# EAGLE design controller_v4 (EAGLE 7.1.0)

## Sheet 1 of 4
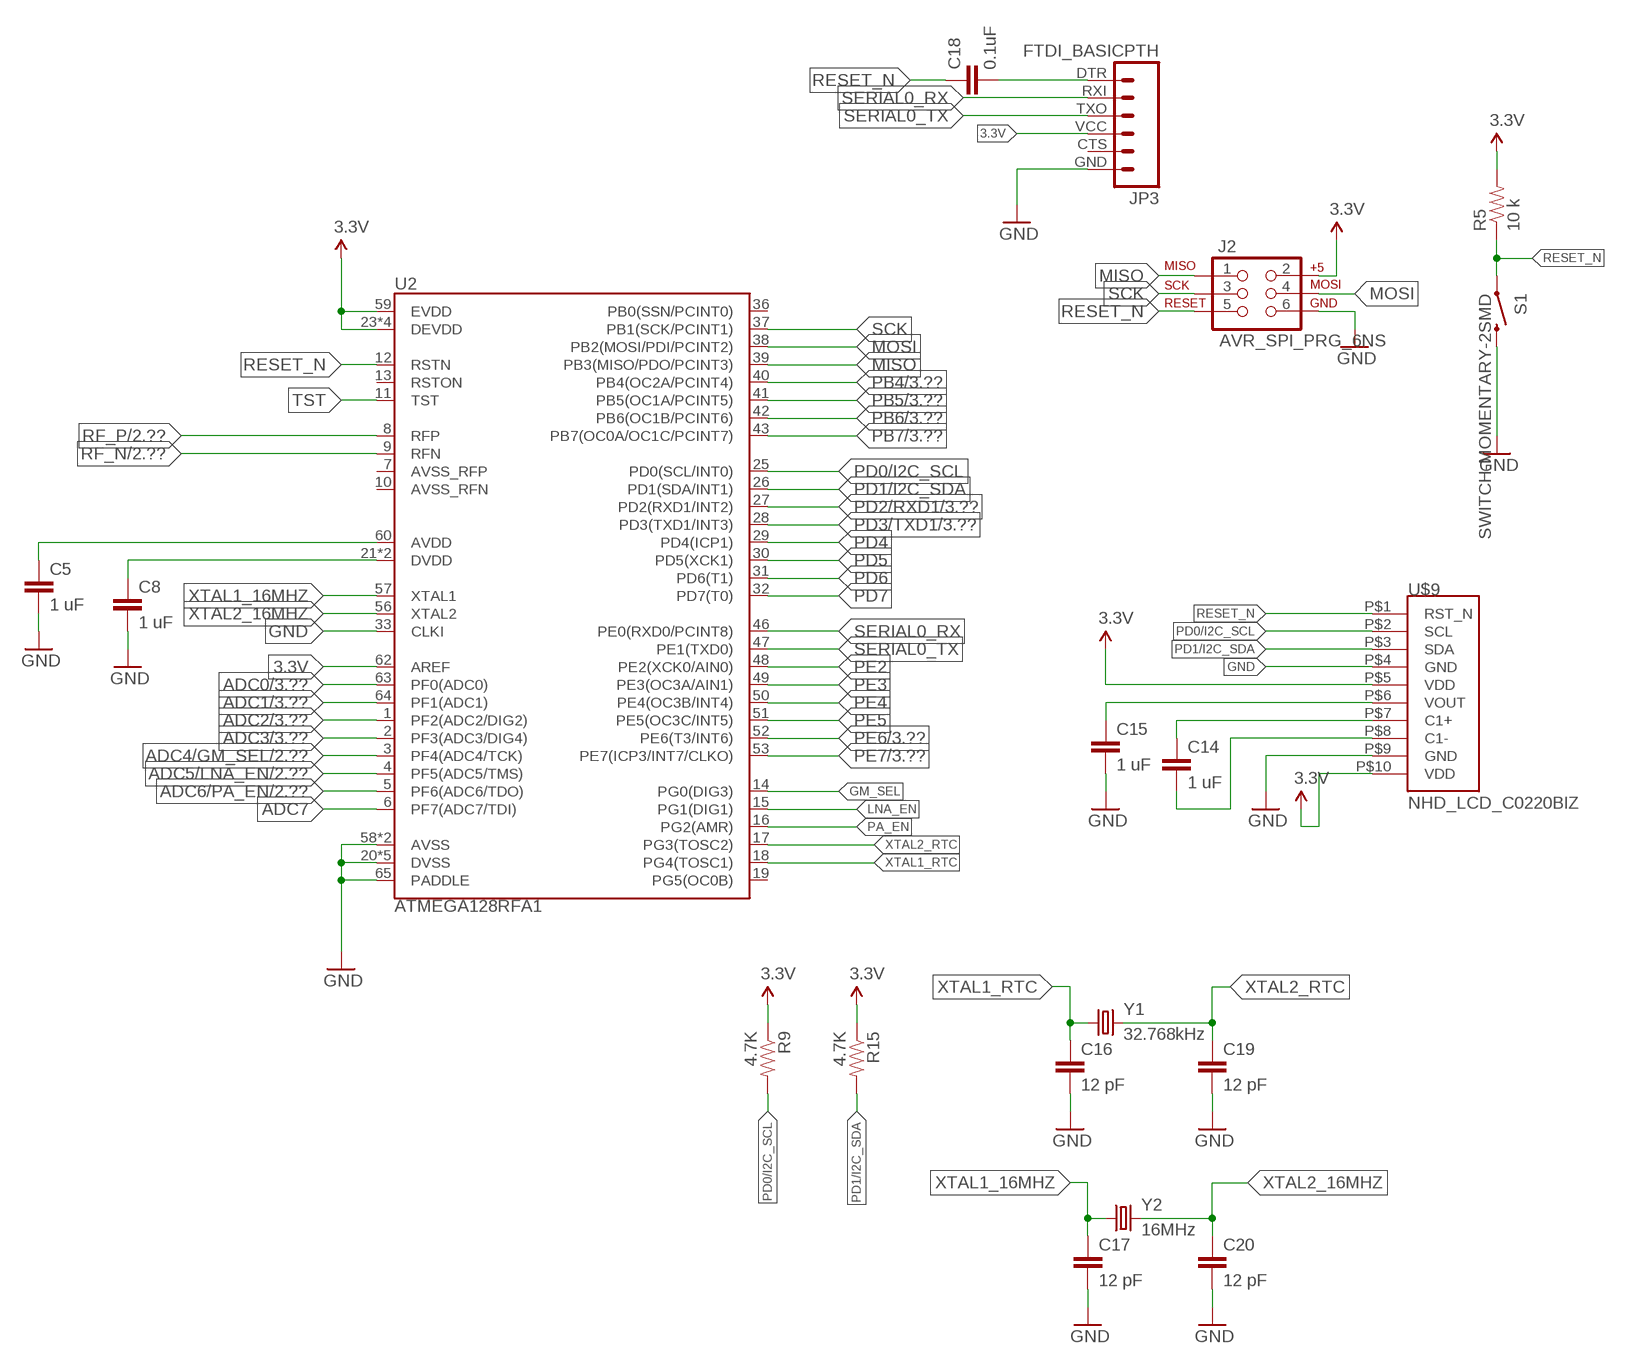
[diagram p0: schematic, sheet 1]

### Parts
C5  1 uF  CAP0805  [0805]
C8  1 uF  CAP0805  [0805]
C14  1 uF  CAP0805  [0805]
C15  1 uF  CAP0805  [0805]
C16  12 pF  CAP0805  [0805]
C17  12 pF  CAP0805  [0805]
C18  0.1uF  CAP0805  [0805]
C19  12 pF  CAP0805  [0805]
C20  12 pF  CAP0805  [0805]
J2  AVR_SPI_PRG_6NS  [2X3-NS]
JP3  FTDI_BASICPTH  [FTDI_BASIC]
R5  10 k  RESISTOR0805-RES  [0805]
R9  4.7K  RESISTOR0805-RES  [0805]
R15  4.7K  RESISTOR0805-RES  [0805]
S1  SWITCH-MOMENTARY-2SMD  [TACTILE_SWITCH_SMD]
U2  ATMEGA128RFA1  [QFN-64]
U$9  NHD_LCD_C0220BIZ  [1X08-2MMPTH-LCD]
Y1  32.768kHz  CRYSTAL32-SMD  [CRYSTAL-32KHZ-SMD]
Y2  16MHz  CRYSTAL5X3  [CRYSTAL-SMD-5X3]

### Nets
3.3V: J2.2 JP3.VCC R5.2 R9.1 R15.1 U2.23(DEVDD) U2.34(DEVDD) U2.44(DEVDD) U2.54(DEVDD) U2.59(EVDD) U2.62(AREF) U$9.P$5(VDD) U$9.P$10(VDD) ; also sheet 2,3,4
ADC0: U2.63(PF0(ADC0)) ; also sheet 3
ADC1: U2.64(PF1(ADC1)) ; also sheet 3
ADC2: U2.1(PF2(ADC2/DIG2)) ; also sheet 3
ADC3: U2.2(PF3(ADC3/DIG4)) ; also sheet 3
ADC4/GM_SEL: U2.3(PF4(ADC4/TCK)) ; also sheet 2
ADC5/LNA_EN: U2.4(PF5(ADC5/TMS)) ; also sheet 2
ADC6/PA_EN: U2.5(PF6(ADC6/TDO)) ; also sheet 2
ADC7: U2.6(PF7(ADC7/TDI))
GM_SEL: U2.14(PG0(DIG3))
GND: C5.2 C8.2 C15.2 C16.2 C17.2 C19.2 C20.2 J2.6 JP3.GND S1.3 U2.20(DVSS) U2.24(DVSS) U2.33(CLKI) U2.35(DVSS) U2.45(DVSS) U2.55(DVSS) U2.58(AVSS) U2.61(AVSS) U2.65(PADDLE) U$9.P$4(GND) U$9.P$9(GND) ; also sheet 2,3,4
LNA_EN: U2.15(PG1(DIG1))
MISO: J2.1 U2.39(PB3(MISO/PDO/PCINT3))
MOSI: J2.4 U2.38(PB2(MOSI/PDI/PCINT2))
N$2: C18.2 JP3.DTR
N$5: C14.1 U$9.P$7(C1+)
N$15: C5.1 U2.60(AVDD)
N$16: C8.1 U2.21(DVDD) U2.22(DVDD)
N$22: C14.2 U$9.P$8(C1-)
PA_EN: U2.16(PG2(AMR))
PB4: U2.40(PB4(OC2A/PCINT4)) ; also sheet 3
PB5: U2.41(PB5(OC1A/PCINT5)) ; also sheet 3
PB6: U2.42(PB6(OC1B/PCINT6)) ; also sheet 3
PB7: U2.43(PB7(OC0A/OC1C/PCINT7)) ; also sheet 3
PD0/I2C_SCL: R9.2 U2.25(PD0(SCL/INT0)) U$9.P$2(SCL)
PD1/I2C_SDA: R15.2 U2.26(PD1(SDA/INT1)) U$9.P$3(SDA)
PD2/RXD1: U2.27(PD2(RXD1/INT2)) ; also sheet 3
PD3/TXD1: U2.28(PD3(TXD1/INT3)) ; also sheet 3
PD4: U2.29(PD4(ICP1))
PD5: U2.30(PD5(XCK1))
PD6: U2.31(PD6(T1))
PD7: U2.32(PD7(T0))
PE2: U2.48(PE2(XCK0/AIN0))
PE3: U2.49(PE3(OC3A/AIN1))
PE4: U2.50(PE4(OC3B/INT4))
PE5: U2.51(PE5(OC3C/INT5))
PE6: U2.52(PE6(T3/INT6)) ; also sheet 3
PE7: U2.53(PE7(ICP3/INT7/CLKO)) ; also sheet 3
RESET_N: C18.1 J2.5 R5.1 S1.1 U2.12(RSTN) U$9.P$1(RST_N)
RF_N: U2.9(RFN) ; also sheet 2
RF_P: U2.8(RFP) ; also sheet 2
SCK: J2.3 U2.37(PB1(SCK/PCINT1))
SERIAL0_RX: JP3.RXI U2.46(PE0(RXD0/PCINT8))
SERIAL0_TX: JP3.TXO U2.47(PE1(TXD0))
TST: U2.11(TST)
VOUT: C15.1 U$9.P$6(VOUT)
XTAL1_16MHZ: C17.1 U2.57(XTAL1) Y2.1
XTAL1_RTC: C16.1 U2.18(PG4(TOSC1)) Y1.X1
XTAL2_16MHZ: C20.1 U2.56(XTAL2) Y2.3
XTAL2_RTC: C19.1 U2.17(PG3(TOSC2)) Y1.X2
Unconnected: JP3.CTS U2.7(AVSS_RFP) U2.10(AVSS_RFN) U2.13(RSTON) U2.19(PG5(OC0B)) U2.36(PB0(SSN/PCINT0))

## Sheet 2 of 4
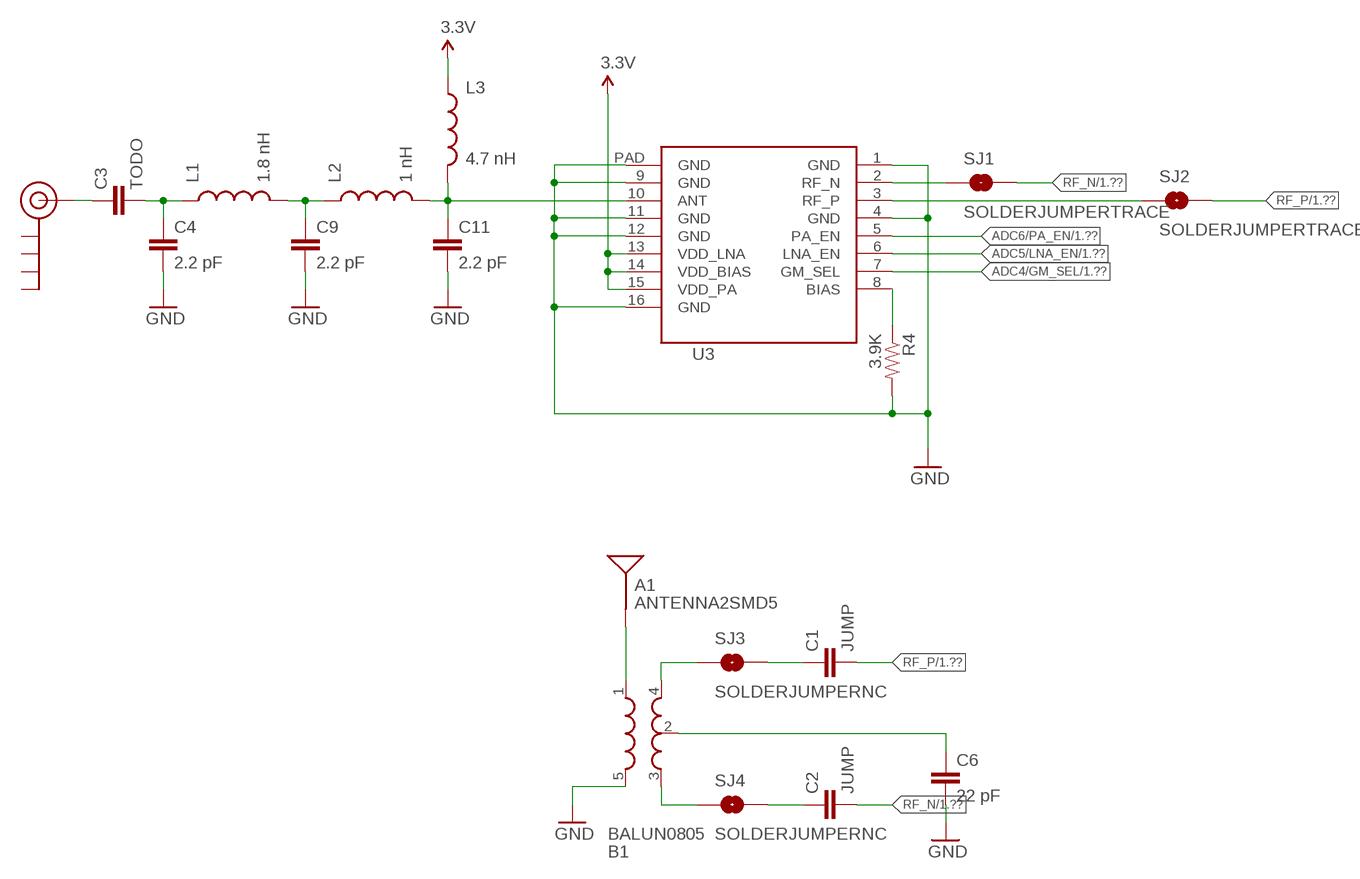
[diagram p1: schematic, sheet 2]

### Parts
A1  ANTENNA2SMD5  [ANTENNA-CHIP5]
B1  BALUN0805  [BALUN]
C1  JUMP  CAP0805  [0805]
C2  JUMP  CAP0805  [0805]
C3  TODO  CAP0805  [0805]
C4  2.2 pF  CAP0805  [0805]
C6  22 pF  CAP0805  [0805]
C9  2.2 pF  CAP0805  [0805]
C11  2.2 pF  CAP0805  [0805]
J$1  SMA_EDGE  [SMA-EDGE]
L1  1.8 nH  INDUCTOR0805  [0805]
L2  1 nH  INDUCTOR0805  [0805]
L3  4.7 nH  INDUCTOR0805  [0805]
R4  3.9K  RESISTOR0805-RES  [0805]
SJ1  SOLDERJUMPERTRACE  [SJ_2S-TRACE]
SJ2  SOLDERJUMPERTRACE  [SJ_2S-TRACE]
SJ3  SOLDERJUMPERNC  [SJ_2S]
SJ4  SOLDERJUMPERNC  [SJ_2S]
U3  RF_AMPLIFIER  CC2592QF  [QFN65P400X400X100-17N]

### Nets
3.3V: L3.1 U3.13(VDD_LNA) U3.14(VDD_BIAS) U3.15(VDD_PA) ; also sheet 1,3,4
ADC4/GM_SEL: U3.7(GM_SEL) ; also sheet 1
ADC5/LNA_EN: U3.6(LNA_EN) ; also sheet 1
ADC6/PA_EN: U3.5(PA_EN) ; also sheet 1
GND: B1.5(GND) C4.2 C6.2 C9.2 C11.2 R4.2 U3.1(GND) U3.4(GND) U3.9(GND) U3.11(GND) U3.12(GND) U3.16(GND) U3.PAD(GND) ; also sheet 1,3,4
N$1: C9.1 L1.2 L2.1
N$3: C11.1 L2.2 L3.2 U3.10(ANT)
N$4: C3.2 C4.1 L1.1
N$6: SJ1.1 U3.2(RF_N)
N$7: R4.1 U3.8(BIAS)
N$8: C3.1 J$1.SIG(SIGNAL)
N$9: B1.4(OUT1) SJ3.1
N$10: B1.3(OUT2) SJ4.1
N$11: B1.2(GND) C6.1
N$12: A1.FEED(SIGNAL) B1.1(IN)
N$13: C1.1 SJ3.2
N$14: C2.1 SJ4.2
N$17: SJ2.1 U3.3(RF_P)
RF_N: C2.2 SJ1.2 ; also sheet 1
RF_P: C1.2 SJ2.2 ; also sheet 1
Unconnected: J$1.GND@0(GND) J$1.GND@1(GND) J$1.GND@2(GND) J$1.GND@3(GND)

## Sheet 3 of 4
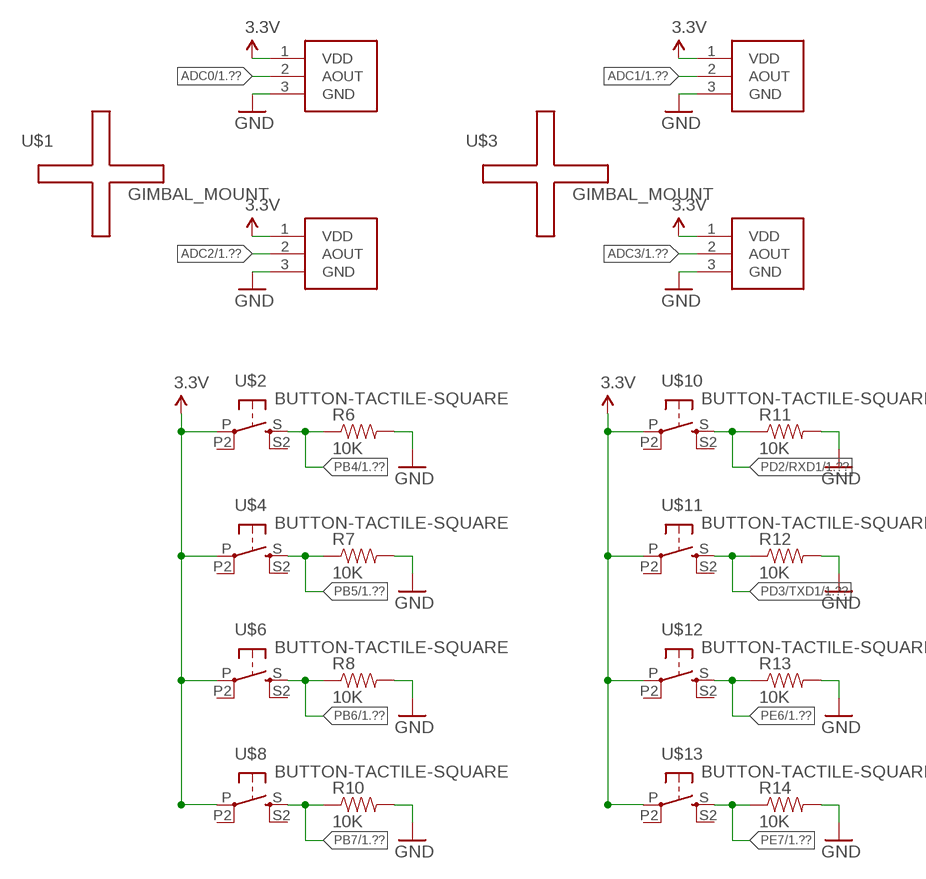
[diagram p2: schematic, sheet 3]

### Parts
J3  GIMBAL_3PIN  [JST-3-PTH]
J4  GIMBAL_3PIN  [JST-3-PTH]
J5  GIMBAL_3PIN  [JST-3-PTH]
J6  GIMBAL_3PIN  [JST-3-PTH]
R6  10K  RESISTOR0805-RES  [0805]
R7  10K  RESISTOR0805-RES  [0805]
R8  10K  RESISTOR0805-RES  [0805]
R10  10K  RESISTOR0805-RES  [0805]
R11  10K  RESISTOR0805-RES  [0805]
R12  10K  RESISTOR0805-RES  [0805]
R13  10K  RESISTOR0805-RES  [0805]
R14  10K  RESISTOR0805-RES  [0805]
U$1  GIMBAL_MOUNT  [GIMBAL_FOOTPRINT]
U$2  BUTTON-TACTILE-SQUARE  [BUTTON-TACTILE-SQUARE-ADAFRUIT1010]
U$3  GIMBAL_MOUNT  [GIMBAL_FOOTPRINT]
U$4  BUTTON-TACTILE-SQUARE  [BUTTON-TACTILE-SQUARE-ADAFRUIT1010]
U$6  BUTTON-TACTILE-SQUARE  [BUTTON-TACTILE-SQUARE-ADAFRUIT1010]
U$8  BUTTON-TACTILE-SQUARE  [BUTTON-TACTILE-SQUARE-ADAFRUIT1010]
U$10  BUTTON-TACTILE-SQUARE  [BUTTON-TACTILE-SQUARE-ADAFRUIT1010]
U$11  BUTTON-TACTILE-SQUARE  [BUTTON-TACTILE-SQUARE-ADAFRUIT1010]
U$12  BUTTON-TACTILE-SQUARE  [BUTTON-TACTILE-SQUARE-ADAFRUIT1010]
U$13  BUTTON-TACTILE-SQUARE  [BUTTON-TACTILE-SQUARE-ADAFRUIT1010]

### Nets
3.3V: J3.1(VDD) J4.1(VDD) J5.1(VDD) J6.1(VDD) U$2.P U$4.P U$6.P U$8.P U$10.P U$11.P U$12.P U$13.P ; also sheet 1,2,4
ADC0: J6.2(AOUT) ; also sheet 1
ADC1: J3.2(AOUT) ; also sheet 1
ADC2: J5.2(AOUT) ; also sheet 1
ADC3: J4.2(AOUT) ; also sheet 1
GND: J3.3(GND) J4.3(GND) J5.3(GND) J6.3(GND) R6.2 R7.2 R8.2 R10.2 R11.2 R12.2 R13.2 R14.2 ; also sheet 1,2,4
PB4: R6.1 U$2.S ; also sheet 1
PB5: R7.1 U$4.S ; also sheet 1
PB6: R8.1 U$6.S ; also sheet 1
PB7: R10.1 U$8.S ; also sheet 1
PD2/RXD1: R11.1 U$10.S ; also sheet 1
PD3/TXD1: R12.1 U$11.S ; also sheet 1
PE6: R13.1 U$12.S ; also sheet 1
PE7: R14.1 U$13.S ; also sheet 1
Unconnected: U$2.P2(P1) U$2.S2(S1) U$4.P2(P1) U$4.S2(S1) U$6.P2(P1) U$6.S2(S1) U$8.P2(P1) U$8.S2(S1) U$10.P2(P1) U$10.S2(S1) U$11.P2(P1) U$11.S2(S1) U$12.P2(P1) U$12.S2(S1) U$13.P2(P1) U$13.S2(S1)

## Sheet 4 of 4
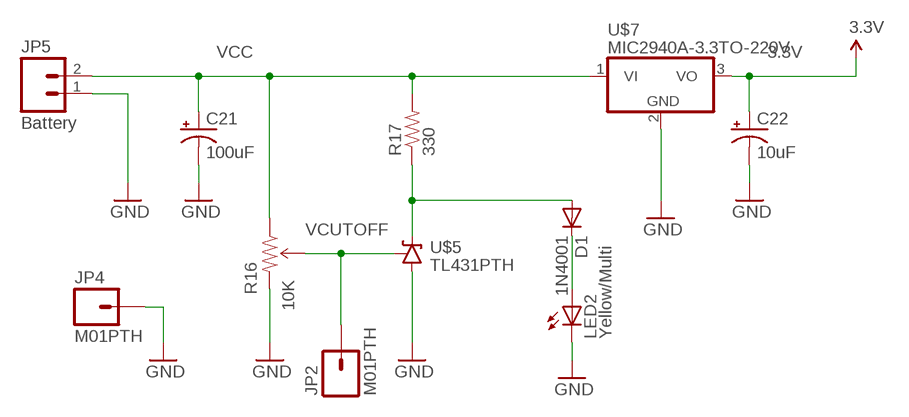
[diagram p3: schematic, sheet 4]

### Parts
C21  100uF  CPOL-USE3.5-8  [E3,5-8]
C22  10uF  CPOL-USE2.5-5  [E2,5-5]
D1  1N4001  1N4004  [DO41-10]
JP2  M01PTH  [1X01]
JP4  M01PTH  [1X01]
JP5  Battery  M02PTH  [1X02]
LED2  Yellow/Multi  LED5MM  [LED5MM]
R16  10K  TRIMPOT-PTH-KNOB  [3386U]
R17  330  RESISTORAXIAL-0.3  [AXIAL-0.3]
U$5  TL431PTH  [TO-92]
U$7  MIC2940A-3.3TO-220V  [TO-220V]

### Nets
3.3V: C22.+ U$7.3(VO) ; also sheet 1,2,3
GND: C21.- C22.- JP4.1 JP5.1 LED2.K(C) R16.3(CW) U$5.2(A) U$7.2(GND) ; also sheet 1,2,3
N$20: D1.A R17.P$1 U$5.3(C)
N$21: D1.C LED2.A
VCC: C21.+ JP5.2 R16.1(CCW) R17.P$2 U$7.1(VI)
VCUTOFF: JP2.1 R16.2(WIPER) U$5.1(R)

## Library data of the parts
A1 = Controller:ANTENNA2: Chip antenna Single endded antenna. Common with smaller chip antennas. CHIP4 package is the GPS Chip Antenna SKU: GPS-08418. CHIP5 package is 2.4GHz chip antenna SKU: WRL-00144.
B1 = Controller:BALUN: 0805 footprint balun- Ember 351/357
C1-C6 C8 C9 C11 C14-C20 = Controller:CAP: Capacitor Standard 0603 ceramic capacitor, and 0.1" leaded capacitor.
C21 C22 = rcl:CPOL-US: POLARIZED CAPACITOR, American symbol
D1 = diode:1N4004: DIODE general purpose rectifier, 1 A
J2 = Controller:AVR_SPI_PRG_6: AVR ISP 6 Pin This is the reduced ISP connector for AVR programming. Common on Arduino. This footprint will take up less PCB space and can be used with a 10-pin to 6-pin adapter such as SKU: BOB-08508
J3-J6 = Controller:GIMBAL_3PIN: This is the surface mount connector for the 9XR Replacement Gimbal. It uses a 3 Pin, 2 mm Pitch, JST connector (https://www.sparkfun.com/products/9750) You can see the analog transmitter here: http://www.hobbyking.com/hobbyking/store/__39505__Transmitter_Gimbal_Set_Left_Turnigy_9XR_Transmitter_Mode_1.html The black wire is VDD, the White wire is Ground, the Red wire is Analog Out Author: Dustin Richmond Created: 10/25/2014
J$1 = Controller:SMA_EDGE: SMA Antenna Connector End launch SMA connector. The paste layer has been removed so that the connector can be hand soldered onto the board after reflow.
JP2 JP4 = SparkFun:M01: Header 1 Standard 1-pin 0.1" header. Use with straight break away headers (SKU : PRT-00116), right angle break away headers (PRT-00553), swiss pins (PRT-00743), machine pins (PRT-00117), and female headers (PRT-00115).
JP3 = Controller:FTDI_BASIC: FTDI Basic header with labels
JP5 = SparkFun:M02: Header 2 Standard 2-pin 0.1" header. Use with straight break away headers (SKU : PRT-00116), right angle break away headers (PRT-00553), swiss pins (PRT-00743), machine pins (PRT-00117), and female headers (PRT-00115). Molex polarized connector foot print use with SKU : PRT-08233 with associated crimp pins and housings.
L1-L3 = Controller:INDUCTOR: Inductors Basic Inductor/Choke - 0603 and 1206. Footprints are not proven and vary greatly between part numbers. SRN6045- 33uH, 20% 1.4A SDR0403-560KL - 56uH, 10%, 500mA RMS/740mA peak
LED2 = SparkFun:LED: LEDs Standard schematic elements and footprints for 5mm, 3mm, 1206, and 0603 sized LEDs. 5mm - Spark Fun Electronics SKU : COM-00529 (and others)
R4-R15 = Controller:RESISTOR: Resistor Basic schematic elements and footprints for 0603, 1206, and PTH resistors.
R16 = SparkFun:TRIMPOT
R17 = SparkFun:RESISTOR: Resistor Basic schematic elements and footprints for 0603, 1206, and PTH resistors.
S1 = Controller:SWITCH-MOMENTARY-2: Various NO switches- pushbuttons, reed, etc
SJ1-SJ4 = Controller:SOLDERJUMPER: Solder Jumper Standard SMD solder jumper. Used to automate production. Two varients : Normally Open and Normally Closed are the same, but have different paste layers. NC will have a large amount of paste and should jumper during reflow.
U2 = Controller:ATMEGA128RFA1: ATmega128RFA1 8-bit AVR Microcontroller with Low Power 2.4GHz Transceiver for ZigBee and IEEE 802.15.4
U3 = Controller:CC2592: Device Symbol for the CC2592 QFN16 RF Amplifier Chip from Texas Instruments. Description: The CC2592 device is a cost-effective and high-performance RF front end for low-power and low-voltage 2.4-GHz wireless applications.The CC2592 device is a range extender for all CC25XX 2.4-GHz low-power RF transceivers, transmitters, and system-on-chip products from Texas Instruments.To increase the link budget, the CC2592 device provides a power amplifier for increased output power and an LNA with a low-noise figure for improved receiver sensitivity.The CC2592 device provides a very small size, high-output power RF design with its 4-mm × 4-mm QFN-16 package.The CC2592 device contains PA, LNA, switches, RF-matching, and balun for simple design of high-performance wireless applications Datasheet: http://www.ti.com/general/docs/lit/getliterature.tsp?genericPartNumber=cc2592&fileType=pdf Note: I have NOT added the thermal pads expected in the datasheet. These should be added by the end user on their PCB Author: Dustin Richmond Date Created: 10/16/2014 Reviewer 1: Reviewer 2:
U$1 U$3 = Controller:GIMBAL_MOUNT
U$2 U$4 U$6 U$8 U$10-U$13 = Controller:BUTTON-TACTILE
U$5 = SparkFun:TL431
U$7 = SparkFun:MIC2940A-3.3: MIC2940A-3.3 Voltage Regulator 3.3V mic2940.pdf
U$9 = Controller:NHD_LCD_C0220BIZ: This is the device for the NHD‐C0220BiZ‐FSW‐FBW‐3V3M COG (Chip‐On‐Glass) Character Liquid Crystal Display Module. Datasheet: http://www.newhavendisplay.com/specs/NHD-C0220BiZ-FSW-FBW-3V3M.pdf Author: Dustin Richmond Created: 10/25/2014
Y1 Y2 = Controller:CRYSTAL: Various standard crystals. Proven footprints. Spark Fun Electronics SKU : COM-00534

## Board
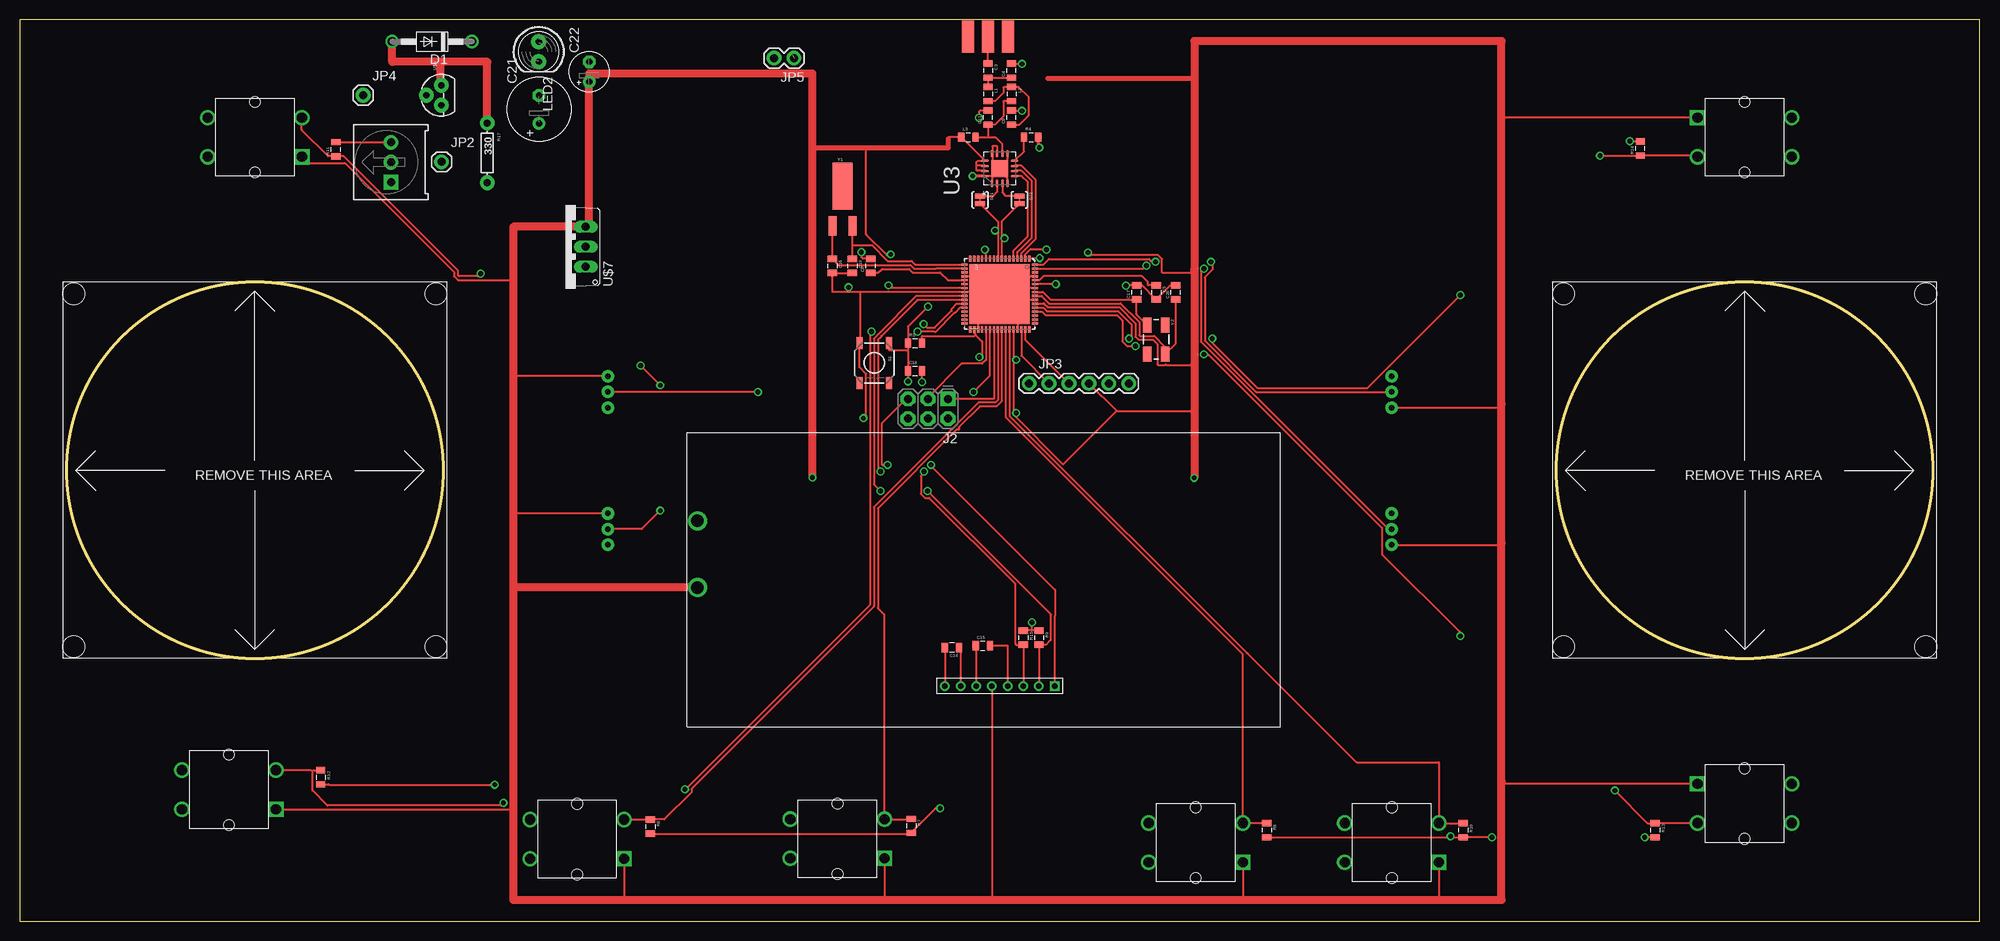
[diagram p4: board, top side]
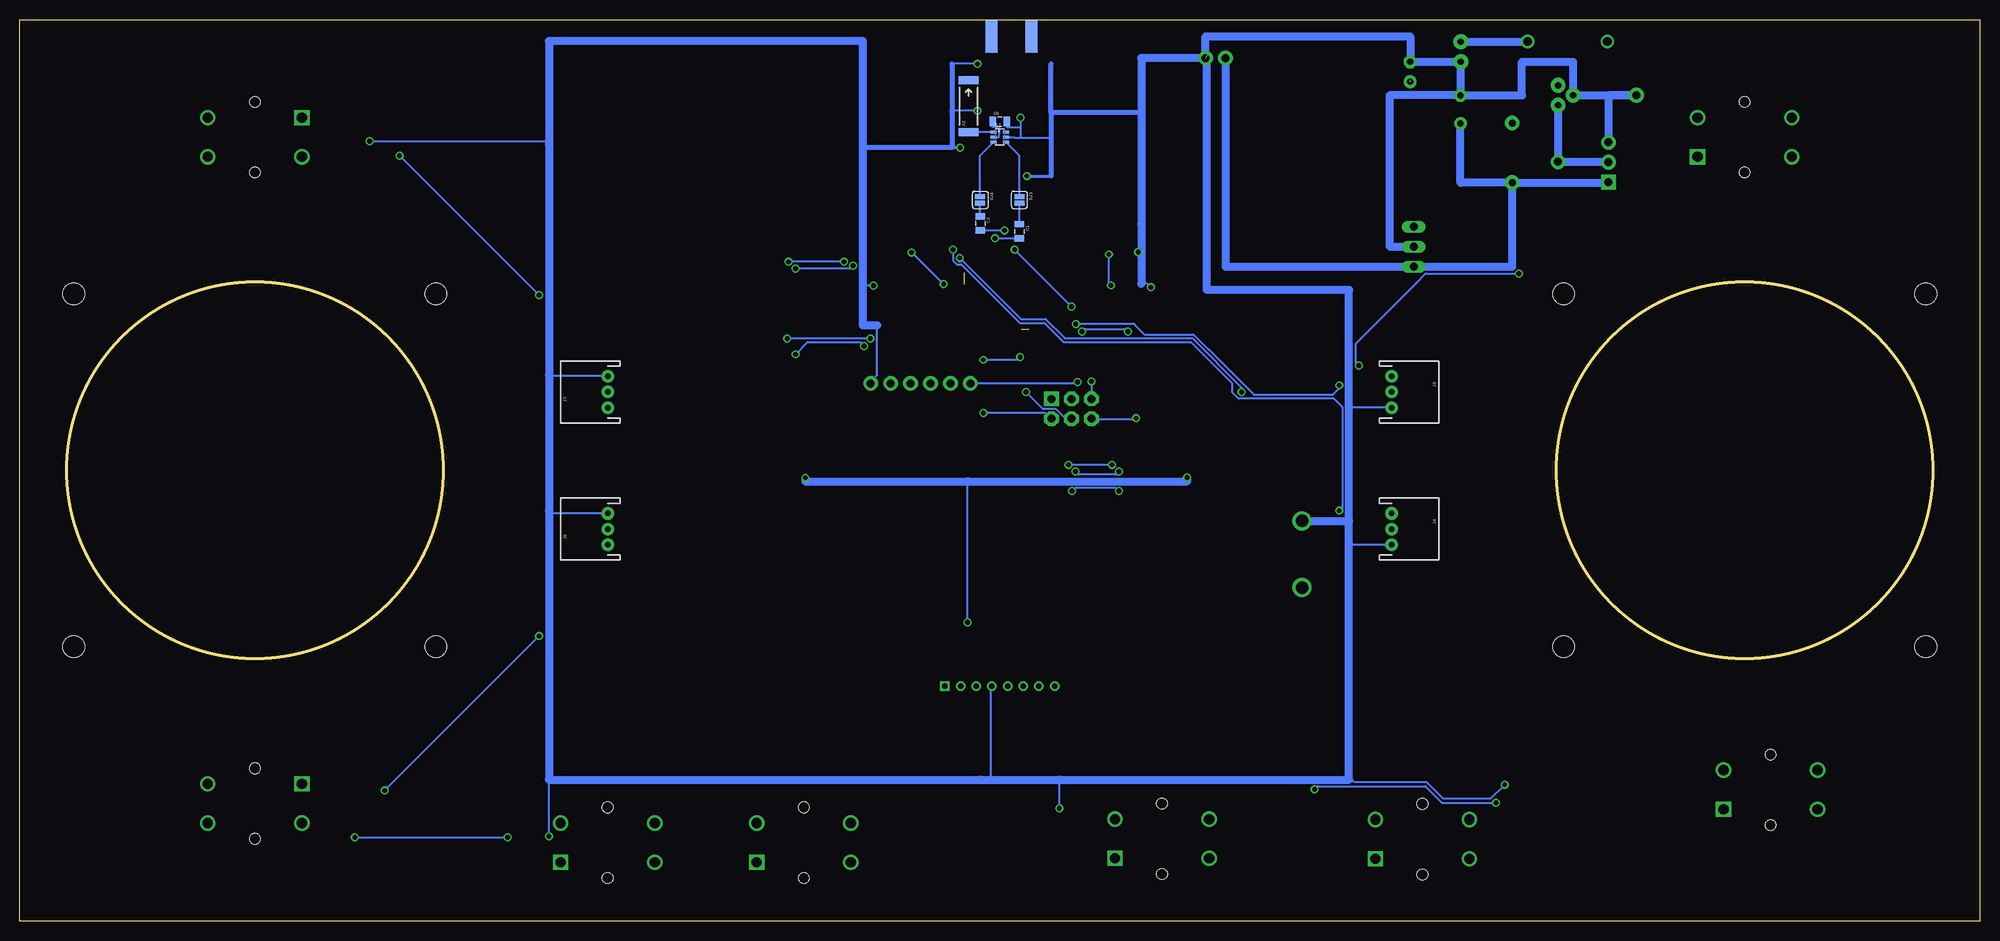
[diagram p5: board, bottom side, seen from below]

Size 250 x 115 mm. Coordinates in mm from the lower left corner, seen from the top.
Outline: 0,0 250,0 250,115 0,115 0,0
Copper layers (1*16): Top 0.035mm / dielectric 1.5mm / Bottom 0.035mm
Design rules "default": minimum track width 10mil, minimum drill 24mil, track to track 8mil, track to pad 8mil, pad to pad 8mil, via to via 8mil, smd to smd 8mil, copper to edge 40mil, drill to drill 8mil, minimum pad ring 10mil, minimum via ring 8mil, stop-mask expansion 4mil, vias tented up to drill 0mil, thermal gap 10mil

### Footprints (pad centres in the part's own frame; a part is rotated, then mirrored left to right if it is on the bottom)
ANTENNA-CHIP5 = smd 1.016 x 2.54: FEED -3.302,0; NC 3.302,0
BALUN = smd 0.35 x 0.8: 1 -0.65,-0.8; 2 0,-0.8; 3 0.65,-0.8; 4 0.65,0.8; 5 0,0.8; 6 -0.65,0.8
0805 = smd 0.8 x 1.2: 1 -0.9,0; 2 0.9,0
E3,5-8 = drill 0.813 pad 1.6: + -1.778,0 | drill 0.813 pad 1.6 octagon: - 1.778,0
E2,5-5 = drill 0.813 pad 1.6: + -1.27,0 | drill 0.813 pad 1.6 octagon: - 1.27,0
DO41-10 = drill 1.118: A 5.08,0; C -5.08,0
2X3-NS = drill 1.016 pad 1.88 square: 1 -2.54,-1.27 | drill 1.016 pad 1.88 octagon: 2 -2.54,1.27; 3 0,-1.27; 4 0,1.27; 5 2.54,-1.27; 6 2.54,1.27
JST-3-PTH = drill 0.7 pad 1.6: 1 -2,0; 2 0,0; 3 2,0
SMA-EDGE = smd 1.524 x 4.064: GND@0 0,0; GND@1 5.08,0; SIG 2.54,0 | smd 1.524 x 4.064 bottom: GND@2 0,0; GND@3 5.08,0
1X01 = drill 1.016 pad 1.88: 1 0,0
FTDI_BASIC = drill 1.016 pad 1.88: CTS 10.16,0; DTR 0,0; GND 12.7,0; RXI 2.54,0; TXO 5.08,0; VCC 7.62,0
1X02 = drill 1.016 pad 1.88: 1 0,0; 2 2.54,0
LED5MM = drill 0.813 pad 1.88: A -1.27,0; K 1.27,0
3386U = drill 1.016 pad 1.88 square: 1 -2.54,-0.015 | drill 1.016 pad 1.88: 2 0,-0.015; 3 2.54,-0.015
AXIAL-0.3 = drill 0.9 pad 1.88: P$1 -3.81,0; P$2 3.81,0
TACTILE_SWITCH_SMD = smd 1.524 x 0.762: 1 -2.54,1.905; 2 2.54,1.905; 3 -2.54,-1.905; 4 2.54,-1.905
SJ_2S-TRACE = smd 0.635 x 1.27: 1 -0.508,0; 2 0.508,0
SJ_2S = smd 0.635 x 1.27: 1 -0.412,0; 2 0.412,0
QFN-64 = smd 0.8 x 0.28: 1 -4.5,3.75; 2 -4.5,3.25; 3 -4.5,2.75; 4 -4.5,2.25; 5 -4.5,1.75; 6 -4.5,1.25; 7 -4.5,0.75; 8 -4.5,0.25; 9 -4.5,-0.25; 10 -4.5,-0.75; 11 -4.5,-1.25; 12 -4.5,-1.75; 13 -4.5,-2.25; 14 -4.5,-2.75; 15 -4.5,-3.25; 16 -4.5,-3.75; 33 4.5,-3.75; 34 4.5,-3.25; 35 4.5,-2.75; 36 4.5,-2.25; 37 4.5,-1.75; 38 4.5,-1.25; 39 4.5,-0.75; 40 4.5,-0.25; 41 4.5,0.25; 42 4.5,0.75; 43 4.5,1.25; 44 4.5,1.75; 45 4.5,2.25; 46 4.5,2.75; 47 4.5,3.25; 48 4.5,3.75 | smd 0.28 x 0.8: 17 -3.75,-4.5; 18 -3.25,-4.5; 19 -2.75,-4.5; 20 -2.25,-4.5; 21 -1.75,-4.5; 22 -1.25,-4.5; 23 -0.75,-4.5; 24 -0.25,-4.5; 25 0.25,-4.5; 26 0.75,-4.5; 27 1.25,-4.5; 28 1.75,-4.5; 29 2.25,-4.5; 30 2.75,-4.5; 31 3.25,-4.5; 32 3.75,-4.5; 49 3.75,4.5; 50 3.25,4.5; 51 2.75,4.5; 52 2.25,4.5; 53 1.75,4.5; 54 1.25,4.5; 55 0.75,4.5; 56 0.25,4.5; 57 -0.25,4.5; 58 -0.75,4.5; 59 -1.25,4.5; 60 -1.75,4.5; 61 -2.25,4.5; 62 -2.75,4.5; 63 -3.25,4.5; 64 -3.75,4.5 | smd 7.65 x 7.65: 65 0,0
QFN65P400X400X100-17N = smd 1 x 0.35: 1 -1.9,0.975; 2 -1.9,0.325; 3 -1.9,-0.325; 4 -1.9,-0.975; 9 1.9,-0.975; 10 1.9,-0.325; 11 1.9,0.325; 12 1.9,0.975 | smd 0.35 x 1: 5 -0.975,-1.9; 6 -0.325,-1.9; 7 0.325,-1.9; 8 0.975,-1.9; 13 0.975,1.9; 14 0.325,1.9; 15 -0.325,1.9; 16 -0.975,1.9 | smd 2.16 x 2.16: PAD 0,0
GIMBAL_FOOTPRINT = hole 2.8: -23.1,22.5; -23.1,-22.5; 23.1,-22.5; 23.1,22.5
BUTTON-TACTILE-SQUARE-ADAFRUIT1010 = drill 1.3 square: P -6,2.5 | drill 1.3: P2 6,2.5; S -6,-2.5; S2 6,-2.5 | hole 1.4: 0,4.5; 0,-4.5
TO-92 = drill 0.813 pad 1.88: 1 -1.27,0; 2 0,1.905; 3 1.27,0
TO-220V = drill 1.016 long: 1 -1.27,0; 2 1.27,0; 3 3.81,0
1X08-2MMPTH-LCD = drill 0.7 square: P$1 7,0 | drill 0.7: P$2 5,0; P$3 3,0; P$4 1,0; P$5 -1,0; P$6 -3,0; P$7 -5,0; P$8 -7,0 | drill 1.6: P$9 -38.55,21.05; P$10 -38.55,12.55
CRYSTAL-32KHZ-SMD = smd 2.5 x 6: SHEILD 0,5.08 | smd 1 x 2.5: X1 -1.27,0; X2 1.27,0
CRYSTAL-SMD-5X3 = smd 1.9 x 1.1: 1 -1.85,-1.15; 2 1.85,-1.15; 3 1.85,1.15; 4 -1.85,1.15

### Placement (x,y rotation side)
A1  129,103.95 90 bottom
B1  125,100 270 bottom
C1  122.5,88 270 bottom
C2  127.5,89 270 bottom
C3  123.5,108.5 270 top
C4  126.5,108.5 90 top
C5  144.95,80.2 270 top
C6  125,102 0 bottom
C8  108.53,83.59 90 top
C9  126.5,102.5 90 top
C11  123.5,102.5 90 top
C14  118.9,34.9 180 top
C15  122.85,35.15 0 top
C16  103.65,83.59 270 top
C17  142.45,80.2 90 top
C18  114.2,70.2 0 top
C19  106.2,83.59 270 top
C20  147.45,80.2 90 top
C21  66.25,103.55 90 top
C22  72.65,108.35 90 top
D1  52.6,112.2 180 top
J2  115.85,65.35 180 top
J3  175,67.5 90 bottom
J4  75,50 270 bottom
J5  75,67.5 270 bottom
J6  175,50 90 bottom
J$1  120.95,112.8 0 top
JP2  53.8,96.85 0 top
JP3  128.75,68.6 0 top
JP4  43.8,105.35 0 top
JP5  98.75,110.1 180 top
L1  123.5,105.5 270 top
L2  126.5,105.5 270 top
L3  121,100 0 top
LED2  66.2,110.9 270 top
R4  129,100 0 top
R5  114.2,73.73 0 top
R6  80.45,12.05 270 top
R7  113.7,12.15 270 top
R8  159.05,11.6 270 top
R9  130,36.15 270 top
R10  184.1,11.6 270 top
R11  40.35,98.45 90 top
R12  38.4,18.35 270 top
R13  208.6,11.6 270 top
R14  206.7,98.55 90 top
R15  128,36.15 270 top
R16  47.35,96.8 90 top
R17  59.65,98 270 top
S1  109,71.19 270 top
SJ1  122.5,92 270 top
SJ2  127.5,92 270 top
SJ3  122.5,92 270 bottom
SJ4  127.5,92 270 bottom
U2  125,80 270 top
U3  125,96 90 top
U$1  30,57.5 0 top
U$2  71.1,10.45 180 top
U$3  220,57.5 0 top
U$4  104.3,10.5 180 top
U$5  53.8,105.35 90 top
U$6  150,10 180 top
U$7  72.2,84.75 90 top
U$8  175,10 180 top
U$9  125,30 0 top
U$10  30,100 180 top
U$11  26.7,16.75 180 top
U$12  220,15 0 top
U$13  220,100 0 top
Y1  104.95,88.69 0 top
Y2  144.95,74.2 270 top

### Tracks (layer width: path | path; a pad name or v marks a point on that pad's centre or on a via)
3.3V  (via drill 0.61, 0.61 pad 0.25)  (2 unrouted)
  Top 0.254: J3.1 189,65.5 189,65.9 | J6.1 189,48 189,48.2 | 189,102.5 189,102.55 189.5,102.5 U$13.P | U$12.P 189,17.5 189,17.8 | 124.38,2.7 124.45,2.7 | 149.8,83.05 149.8,82.75 145.7,82.75 145.7,84.45 145.2,84.95 136.6,84.95 v136.25,85.3 | 101.1,80.75 101.1,80.65 | U$6.P 156,3.15 156.45,2.7 | U$4.P 110.3,3.15 109.85,2.7 | J4.1 62.95,52 62.95,51.8 | J5.1 62.95,69.5 62.95,69.4 | U$8.P 181,2.8 181.1,2.7 | U$2.P 77.1,3.2 77.6,2.7 | U$11.P 62.5,14.25 62.95,13.8 | 62.95,81.75 55.9,81.75 55.4,82.25 55.4,82.8 41.5,96.7 36.8,96.7 U$10.P | 118.45,99.8 118.45,100 L3.1 120.1,99.97 U3.13 122.85,97.05 122.85,97 122.2,97 122.05,96.85 122.05,96.35 | 122.05,96.35 122.05,95.75 122.1,95.7 123.1,95.7 U3.15 | 122.05,96.35 123.1,96.35 U3.14 | JP3.VCC 139.92,65.05 | 139.92,65.05 149.8,65.05 | U2.44 126.75,71.6 | 126.75,71.6 126.75,64.8 | 126.75,64.8 126.75,64.6 133.07,58.27 139.8,65 139.92,65.05 | v110.8,81.1 111.15,80.75 U2.23 | 149.8,71 149.8,70.95 146.25,70.95 146.15,71 146.1,70.95 145.15,70.95 145.1,71 145.1,73.6 144.55,74.15 142.7,74.15 142.3,74.55 142.3,76.25 140.25,78.3 131.15,78.3 130.65,78.8 130.55,78.8 130.5,78.75 U2.54 | v132.15,81.25 U2.59 | v127.1,71.6 126.75,71.6 | 111.1,85 v111.1,85.05 111,84.95 110.6,84.95 107.9,87.65 107.95,87.65 107.95,98.65 | 121.92,74.78 121.75,74.95 U2.34 | 121.92,74.78 122.75,73.95 122.75,71.95 v122.4,71.95 | R9.1 129.1,37.05 | 129.1,37.05 R15.1 | U$9.P$5 124,2.7 | 129.1,37.05 v129.1,38.1 | v127.1,64.8 126.75,64.8 | R5.2 115.1,74.6 115.15,74.65 121.8,74.65 121.92,74.78
  Top 0.61: 101.1,95.65 101.1,98.65 107.95,98.65 118.45,98.65 118.45,99.8 | 131.1,107.5 149.8,107.5
  Top 1.016: v149.8,56.55 149.8,65.05 149.8,70.95 149.8,83.05 149.8,107.5 149.8,112.25 189,112.25 189,102.55 189,65.9 189,48.2 189,17.8 189,2.7 181.1,2.7 156.45,2.7 124.45,2.7 124,2.7 109.85,2.7 77.6,2.7 62.95,2.7 62.95,13.8 62.95,42.55 | v101.1,56.6 101.1,80.65 101.1,95.65 101.1,108.1 72.65,108.1 C22.+ | 72.6,107.2 72.6,88.56 U$7.3 62.95,88.56 62.95,81.75 62.95,69.4 62.95,51.8 62.95,42.55 | U$9.P$10 62.95,42.55
  Bottom 0.254: 118.4,64.1 J2.2 118.5,64.15 119.15,64.8 v127.1,64.8 | 136.15,85.2 v136.25,85.3 136.05,85.15 v132.15,81.25 | v127.1,71.6 122.75,71.6 v122.4,71.95 | v111.1,85.05 111.1,81.4 v110.8,81.1 | v129.1,38.1 129.1,56.1
  Bottom 1.016: 149.8,56.1 129.1,56.1 101.1,56.1 v101.1,56.6
ADC0  (via drill 0.61)
  Top 0.254: v143.7,83.6 143.35,83.25 U2.63 | J6.2 174.55,50 150.65,73.9 150.65,82.9 150.95,83.2 v151.05,83.25
  Bottom 0.254: v151.05,83.25 144.05,83.25 v143.7,83.6
ADC1  (via drill 0.61)
  Top 0.254: 152.15,83.9 v151.95,84.1 152.1,83.8 152.1,83.1 151.15,82.15 151.15,74.05 157.7,67.5 J3.2 | v144.85,84.1 144.4,84.1 144.05,84.45 131.25,84.45 130.55,83.75 U2.64
  Bottom 0.254: v144.85,84.1 v151.95,84.1
ADC2  (via drill 0.61)
  Top 0.254: v94.15,67.5 J5.2 | v130.1,84.6 128.75,84.6 U2.1
  Bottom 0.254: v94.15,67.5 94.15,68.05 100.45,74.35 116.7,74.35 119.15,76.8 122.3,76.8 v130.1,84.6
ADC3  (via drill 0.61)
  Top 0.254: U2.2 128.25,85.05 128.95,85.75 130.95,85.75 v130.95,85.65 | J4.2 79.35,50 v81.7,52.35
  Bottom 0.254: v130.95,85.65 130.95,84.25 130.45,83.75 129.9,83.75 122.45,76.3 119.3,76.3 116.85,73.85 100.6,73.85 95.4,68.65 95.4,67.55 95.35,67.45 94.55,66.65 82.4,66.65 81.3,65.55 81.3,52.7 81.4,52.65 v81.7,52.35
ADC4/GM_SEL
  Top 0.254: U2.3 127.75,85.2 129.6,87.05 129.6,94.55 127.8,96.35 126.9,96.35 U3.7
ADC5/LNA_EN
  Top 0.254: U2.4 127.25,85.35 129.1,87.2 129.1,94.4 127.8,95.7 126.9,95.7 U3.6
ADC6/PA_EN
  Top 0.254: U2.5 126.75,85.5 128.6,87.35 128.6,94.25 127.8,95.05 126.9,95.05 U3.5
GND  (via drill 0.61, 0.61 pad 0.25, 0.61 pad 0.41)  (2 unrouted)
  Top 0.254: C15.2 126,35.15 U$9.P$4 | 127.75,80 U2.65 | 127.75,80 128.5,80.75 U2.58 | 122.75,80.25 123.75,80.25 124,80 U2.65 | 122.75,80.25 U2.24 107.25,80.25 | U2.35 122.25,80.15 U2.65 | U2.61 128.95,82.25 128.45,81.75 128.45,80.85 U2.65 | U2.55 127.75,79.25 | 127.75,79.25 127.75,80 | 127.75,79.25 127.25,79.25 U2.45 | U2.20 122.75,82.25 122.75,80.25 | 107.25,80.25 105.7,80.25 | 105.7,80.25 103.65,80.25 C16.2 C19.2 | R6.2 113.6,11.15 R7.2 116.9,14.45 117,14.4 v117.4,14.4 | R8.2 182.5,10.7 | 182.5,10.7 R10.2 v187.75,10.7 | 105.7,80.25 v105.7,80.85 | 147.65,81.3 C20.2 146.75,81.1 C5.2 143.15,81.1 C17.2 141.45,81.1 141.4,81.05 v141.1,81.05 | v205.35,99.5 205.65,99.5 205.7,99.45 R14.2 | v182.5,10.8 182.5,10.7 | R13.2 v207.25,10.7 | R11.2 47.35,99.35 R16.3 | v127.85,109.35 127.55,109.35 127.5,109.4 C4.2 | v127.85,103.35 127.55,103.35 127.5,103.4 C9.2 | v122.35,102.5 122.35,103.25 122.5,103.4 C11.2 | U3.PAD 124.1,96 124.05,96.05 124.05,97.9 U3.12 124.05,98 124.05,98.8 124.1,98.85 124.65,98.85 124.7,98.8 124.7,97.9 U3.11 | U3.PAD 125.9,96 125.95,96.05 125.95,97.25 126,97.3 126,97.9 U3.9 | U3.PAD 125.95,95.9 125.95,94.75 126,94.7 126,94.1 U3.4 | U3.16 123.1,95.05 124.05,95.05 124.15,95.15 124.15,95.9 U3.PAD | U3.PAD 124.05,94.95 124.05,94.1 U3.1 | v107.35,85.35 107.35,84.7 107.55,84.5 108.5,84.5 C8.2 | v60.6,17.4 39.45,17.4 39.4,17.45 R12.2 | 107.25,80.25 107.25,73.95 107.1,73.95 S1.3 107.1,73.55 107.1,70.65 107.95,69.8 107.95,64.5 v107.6,64.15
  Top 0.406: v121.55,95.05 123,95.05 U3.16 | v130.05,98.65 130.05,98.85 129.9,99 R4.2 | 107.1,73.75 S1.3
  Bottom 0.254: J4.3 80.45,48 80.45,48.1 | J5.3 80.45,65.5 80.45,65.55 | J3.3 182.5,69.5 182.5,69.65 | J6.3 182.5,52 182.5,52.4 | 182.5,99.35 182.5,99.1 | 127.06,18.05 127.4,18.05 | 116.9,18.05 117.4,18.05 v117.4,14.4 | 142.65,77.6 142.65,77.7 142.45,76 | 142.45,85.23 142.45,84.75 | U$9.P$4 126.15,29.85 126.15,18.05 | v105.7,80.85 106.1,81.25 106.2,81.3 106.95,81.3 | 107.3,88.5 106.95,88.85 | 142.35,87.45 142.45,87.55 | 131.1,103.15 131.1,103.25 130.8,103.35 v127.85,103.35 | 118.52,109.42 118.45,109.35 | 118.45,100.4 118.45,100.3 | v205.35,99.5 182.5,99.5 | v182.5,10.8 182.5,18.05 | v207.25,10.7 v187.75,10.7 | v127.85,109.35 131.1,109.35 | 122.35,99.95 123.15,99.95 123.2,100 B1.5 | 122.35,99.95 118.45,99.95 | v122.35,102.5 122.35,101.3 | 122.35,101.3 122.35,99.95 | 122.35,101.3 124.1,101.3 C6.2 | v107.35,85.35 106.95,85.35 | v141.1,81.05 142.45,81.05 | 141.45,68.8 JP3.GND 141.4,68.9 140.65,69.65 140.65,76 | v60.6,17.4 62.4,15.6 68.45,15.6 70.55,17.7 79.8,17.7 79.95,17.85 80.45,18.05 | J2.6 113.3,64.05 107.6,64.05 v107.6,64.15
  Bottom 0.406: v121.55,95.05 118.45,95.05 | v130.05,98.65 130.8,98.65 131.1,98.7
  Bottom 0.61: 142.45,98.7 131.1,98.7 131.1,103.25 131.1,109.35 | 106.95,103.15 118.45,103.15 | 118.45,103.15 118.45,100.3 118.45,99.95 118.45,95.05 | 118.45,103.15 118.45,109.35
  Bottom 1.016: 106.95,81.3 106.95,85.35 106.95,88.85 106.95,103.15 106.95,110.1 JP5.1 98.75,112.85 72.65,112.85 C22.- LED2.K 66.25,109.63 C21.- | 80.45,51.05 80.45,48.1 80.45,18.05 117.4,18.05 126.15,18.05 127.4,18.05 182.5,18.05 182.5,52.4 182.5,69.65 182.5,99.1 182.5,99.5 182.5,112.25 142.45,112.25 142.45,98.7 142.45,87.55 142.45,84.75 142.45,81.05 142.45,76 140.65,76 | 80.45,51.05 80.45,65.55 80.45,80.5 98.6,80.5 98.6,110.45 | U$9.P$9 80.45,51.05 | C21.- 75.3,105.33 75.3,86.05 72.2,86.05 U$7.2 | C21.- 58.4,105.33 58.4,109.6 51.9,109.6 U$5.2 JP4.1 47.37,105.35 R16.3
MISO
  Top 0.254: U2.39 124.25,66.62 J2.1
MOSI  (via drill 0.61)
  Top 0.254: U2.38 123.75,69.6 v121.65,67.5
  Bottom 0.254: v121.65,67.5 119.5,65.35 117.85,65.35 116.6,64.1 115.85,64.1 J2.4
N$1
  Top 0.254: L1.2 124.4,104.6 125.45,105.65 125.45,106.35 125.5,106.4 L2.1 127.4,106.4 128.7,105.1 128.7,102.8 127.5,101.6 C9.1
N$2  (via drill 0.61)
  Top 0.254: v115.1,68.75 C18.2
  Bottom 0.254: JP3.DTR 128.7,68.65 115.1,68.65 v115.1,68.75
N$3
  Top 0.254: L3.2 123.55,100 | 123.55,100 124.45,100 125.3,99.15 125.3,97.92 U3.10 | 123.55,100 123.5,100.05 C11.1 124.4,101.6 125.45,102.65 125.45,104.55 125.5,104.6 L2.2
N$4
  Top 0.254: C4.1 C3.2 L1.1
N$5
  Top 0.254: C14.1 120,34.9 U$9.P$7
N$6
  Top 0.254: SJ1.1 124.15,92.51 124.67,93.03 U3.2
N$7
  Top 0.254: U3.8 128.1,98.17 R4.1
N$8
  Top 0.254: C3.1 123.5,112.46 J$1.SIG
N$9
  Bottom 0.254: SJ3.1 122.5,97.65 B1.4
N$10
  Bottom 0.254: SJ4.1 127.5,97.65 B1.3
N$11
  Bottom 0.254: C6.1 125.9,101.3 125.4,101.3 125.05,100.95 125.05,100.35 125.1,100.3 125.1,100.05 125.15,100 B1.2
N$12
  Bottom 0.254: B1.1 A1.FEED
N$13
  Bottom 0.254: C1.1 SJ3.2
N$14
  Bottom 0.254: C2.1 SJ4.2
N$15
  Top 0.254: U2.60 130.05,81.75 130.55,82.25 143.15,82.25 143.9,81.5 143.9,81.15 143.95,81.1 C5.1
N$16
  Top 0.254: U2.22 U2.21 118.4,81.75 117.4,82.75 113.9,82.75 113.45,83.2 110,83.2 109.5,82.7 108.55,82.7 C8.1
N$17
  Top 0.254: SJ2.1 125.75,92.51 125.33,92.93 U3.3
N$20
  Top 1.016: R17.P$1 59.65,109.6 53.7,109.6 | 53.7,109.6 47.52,109.6 D1.A | U$5.3 53.7,106.62 53.7,109.6
N$21
  Bottom 1.016: LED2.A 57.68,112.17 D1.C
N$22
  Top 0.254: C14.2 U$9.P$8
PB4
  Top 0.254: U$2.S R6.1 82.2,12.95 85.7,16.45 85.7,16.9 108.95,40.15 108.95,52.8 122.3,66.15 124.45,66.15 124.75,66.45 U2.40
PB5
  Top 0.254: R7.1 113.65,13 U$4.S 110.25,13.1 110.25,39.15 109.5,39.9 109.45,40 109.45,52.65 119.5,62.7 119.75,62.7 119.8,62.75 119.8,63 122.45,65.65 124.6,65.65 125.25,66.3 U2.41
PB6
  Top 0.254: U2.42 125.75,64.3 156,34.05 U$6.S R8.1
PB7
  Top 0.254: U2.43 126.25,64.45 156.5,34.2 156.6,34.15 170.5,20.25 181,20.25 U$8.S R10.1
PD0/I2C_SCL  (via drill 0.61)
  Top 0.254: U$9.P$2 R9.2 130.9,35.25 131.5,35.85 131.5,39 131.55,39.1 v115.8,54.85 | U2.25 114.35,79.75 109.45,74.85 109.4,74.75 108.95,74.3 108.95,62 108.95,55.7 v109.8,54.85
  Bottom 0.254: v115.8,54.85 115.4,55.25 110.2,55.25 v109.8,54.85
PD1/I2C_SDA  (via drill 0.61)
  Top 0.254: U$9.P$3 R15.2 127.1,35.25 126.95,35.4 126.95,43.05 116,54 115.45,54 114.95,54.5 114.95,56.75 115.05,56.85 115.1,56.95 115.1,57.1 v115.35,57.35 | U2.26 114.5,79.25 109.9,74.65 109.9,74.55 109.7,74.35 109.65,74.35 109.45,74.15 109.45,57.35 v109.8,57.35
  Bottom 0.254: v115.35,57.35 114.95,56.95 110.2,56.95 v109.8,57.35
PD2/RXD1  (via drill 0.61, 0.61 pad 0.25)
  Top 0.254: U$10.S 36,100.9 39.35,97.55 R11.1 41.3,97.55 55.9,82.95 55.9,82.4 56.05,82.25 58.45,82.25 v58.8,82.6 | v81.7,68.35 v79.2,70.85 | U2.27 119.5,78.75 118.85,78.1 118.85,77.85 116.7,75.7 115.75,75.7 v115.3,76.15
  Bottom 0.254: v58.8,82.6 70.7,82.6 71.95,81.35 72,81.25 79.6,73.65 79.6,71.25 v79.2,70.85 | v81.7,68.35 81.55,68.2 81.55,68.1 82.5,67.15 92.6,67.15 98.35,72.9 98.4,73 98.45,73 100.3,74.85 106.55,74.85 107.75,76.05 107.8,76.15 v115.3,76.15
PD3/TXD1  (via drill 0.61, 0.61 pad 0.25)
  Top 0.254: R12.1 37.5,19.25 37.35,19.1 | 37.35,19.1 37.35,16.65 39.25,14.75 61.35,14.75 v61.7,15.1 | v84.85,16.8 84.95,16.8 108.45,40.3 108.45,75.2 v108.65,75.2 | U2.28 119.95,78.25 119.35,77.65 119.25,77.6 116.8,75.15 116.7,75.2 v114.5,75.2 | U$11.S 37.15,19.25 37.25,19.15 37.35,19.1
  Bottom 0.254: v61.7,15.1 68.6,15.1 70.7,17.2 84.45,17.2 v84.85,16.8 | v108.65,75.2 109,75.55 114.15,75.55 v114.5,75.2
PE6  (via drill 0.61)
  Top 0.254: U$12.S R13.1 207.6,12.5 v203.45,16.65 | v183.75,36.35 183.75,36.8 173.75,46.8 173.75,50.15 151.6,72.3 v151.05,72.3 | v142.3,73.35 141.25,73.35 140.65,73.95 140.65,76.6 139.95,77.3 130.85,77.3 130.4,77.75 U2.52
  Bottom 0.254: v183.75,36.35 v203.45,16.65 | v151.05,72.3 149.55,73.8 142.75,73.8 v142.3,73.35
PE7  (via drill 0.61)
  Top 0.254: U$13.S 213.85,97.65 R14.1 v201.55,97.65 | v183.75,79.85 171.9,68 157.85,68 152.1,73.75 v152.1,74.3 | v141.5,74.3 141.8,74.6 141.8,76.1 140.1,77.8 131,77.8 130.55,78.25 U2.53
  Bottom 0.254: v183.75,79.85 v201.55,97.65 | v141.5,74.3 v152.1,74.3
RESET_N  (via drill 0.61)
  Top 0.254: 113.25,72.8 110.95,72.8 110.9,72.85 110.9,73.65 S1.1 | 113.25,72.8 113.3,72.85 R5.1 113.3,75.85 v115.85,78.4 | 113.25,72.8 113.3,72.7 C18.1 v113.3,68.85 | J2.5 113.3,66.6 113.05,66.6 109.95,63.5 109.95,58.25 110,58.2 v110.7,58.2 | 116.2,58.15 v116.25,58.2 116.25,58.05 132.05,42.25 132.05,38.95 132,38.9 U$9.P$1 | v123.1,85.65 123.25,85.5 U2.12
  Bottom 0.254: v113.3,68.85 113.3,66.65 J2.5 | v110.7,58.2 v116.25,58.2 | v123.1,85.65 v115.85,78.4
RF_N  (via drill 0.61 pad 0.25)
  Top 0.254: SJ1.2 124.75,89.24 124.75,88.1 | 124.75,88.1 U2.9 | 124.75,88.1 v124.4,88.1
  Bottom 0.254: v124.4,88.1 C2.2
RF_P  (via drill 0.61 pad 0.25)
  Top 0.254: SJ2.2 125.25,89.24 125.25,87.1 | 125.25,87.1 U2.8 | 125.25,87.1 v125.6,87.1
  Bottom 0.254: v125.6,87.1 C1.2
SCK
  Top 0.254: J2.3 115.85,66.8 120.15,71.1 122.75,71.1 123.25,71.6 U2.37
SERIAL0_RX
  Top 0.254: U2.46 127.75,72.14 JP3.RXI
SERIAL0_TX
  Top 0.254: U2.47 128.25,74.18 JP3.TXO
VCC
  Bottom 1.016: JP5.2 96.21,83.48 U$7.1 59.65,83.48 R17.P$2 | R17.P$2 47.37,94.19 R16.1 | R17.P$2 66.25,94.19 C21.+
VCUTOFF
  Bottom 1.016: U$5.1 JP2.1 47.37,96.85 R16.2
VOUT
  Top 0.254: C15.1 122,35.15 U$9.P$6
XTAL1_16MHZ
  Top 0.254: Y2.1 142.45,77.4 C17.1 131.45,79.3 130.5,80.25 U2.57
XTAL1_RTC
  Top 0.254: U2.18 117.35,83.25 116.9,83.25 114.05,83.25 113.6,83.7 104.47,83.7 103.68,84.49 | C16.1 103.68,84.49 | 103.68,84.49 Y1.X1
XTAL2_16MHZ
  Top 0.254: C20.1 147.45,73.7 Y2.3 146.15,72.55 146.1,72.55 146.1,73.25 144.7,74.65 142.85,74.65 142.8,74.7 142.8,76.4 140.4,78.8 131.3,78.8 130.35,79.75 U2.56
XTAL2_RTC
  Top 0.254: C19.1 106.22,84.49 106.22,86.2 | 106.22,86.2 Y1.X2 | U2.17 114.2,83.75 113.75,84.2 110.7,84.2 108.7,86.2 106.22,86.2